# EAGLE design OSB_Motherboard_RevA (EAGLE 9.5.1)
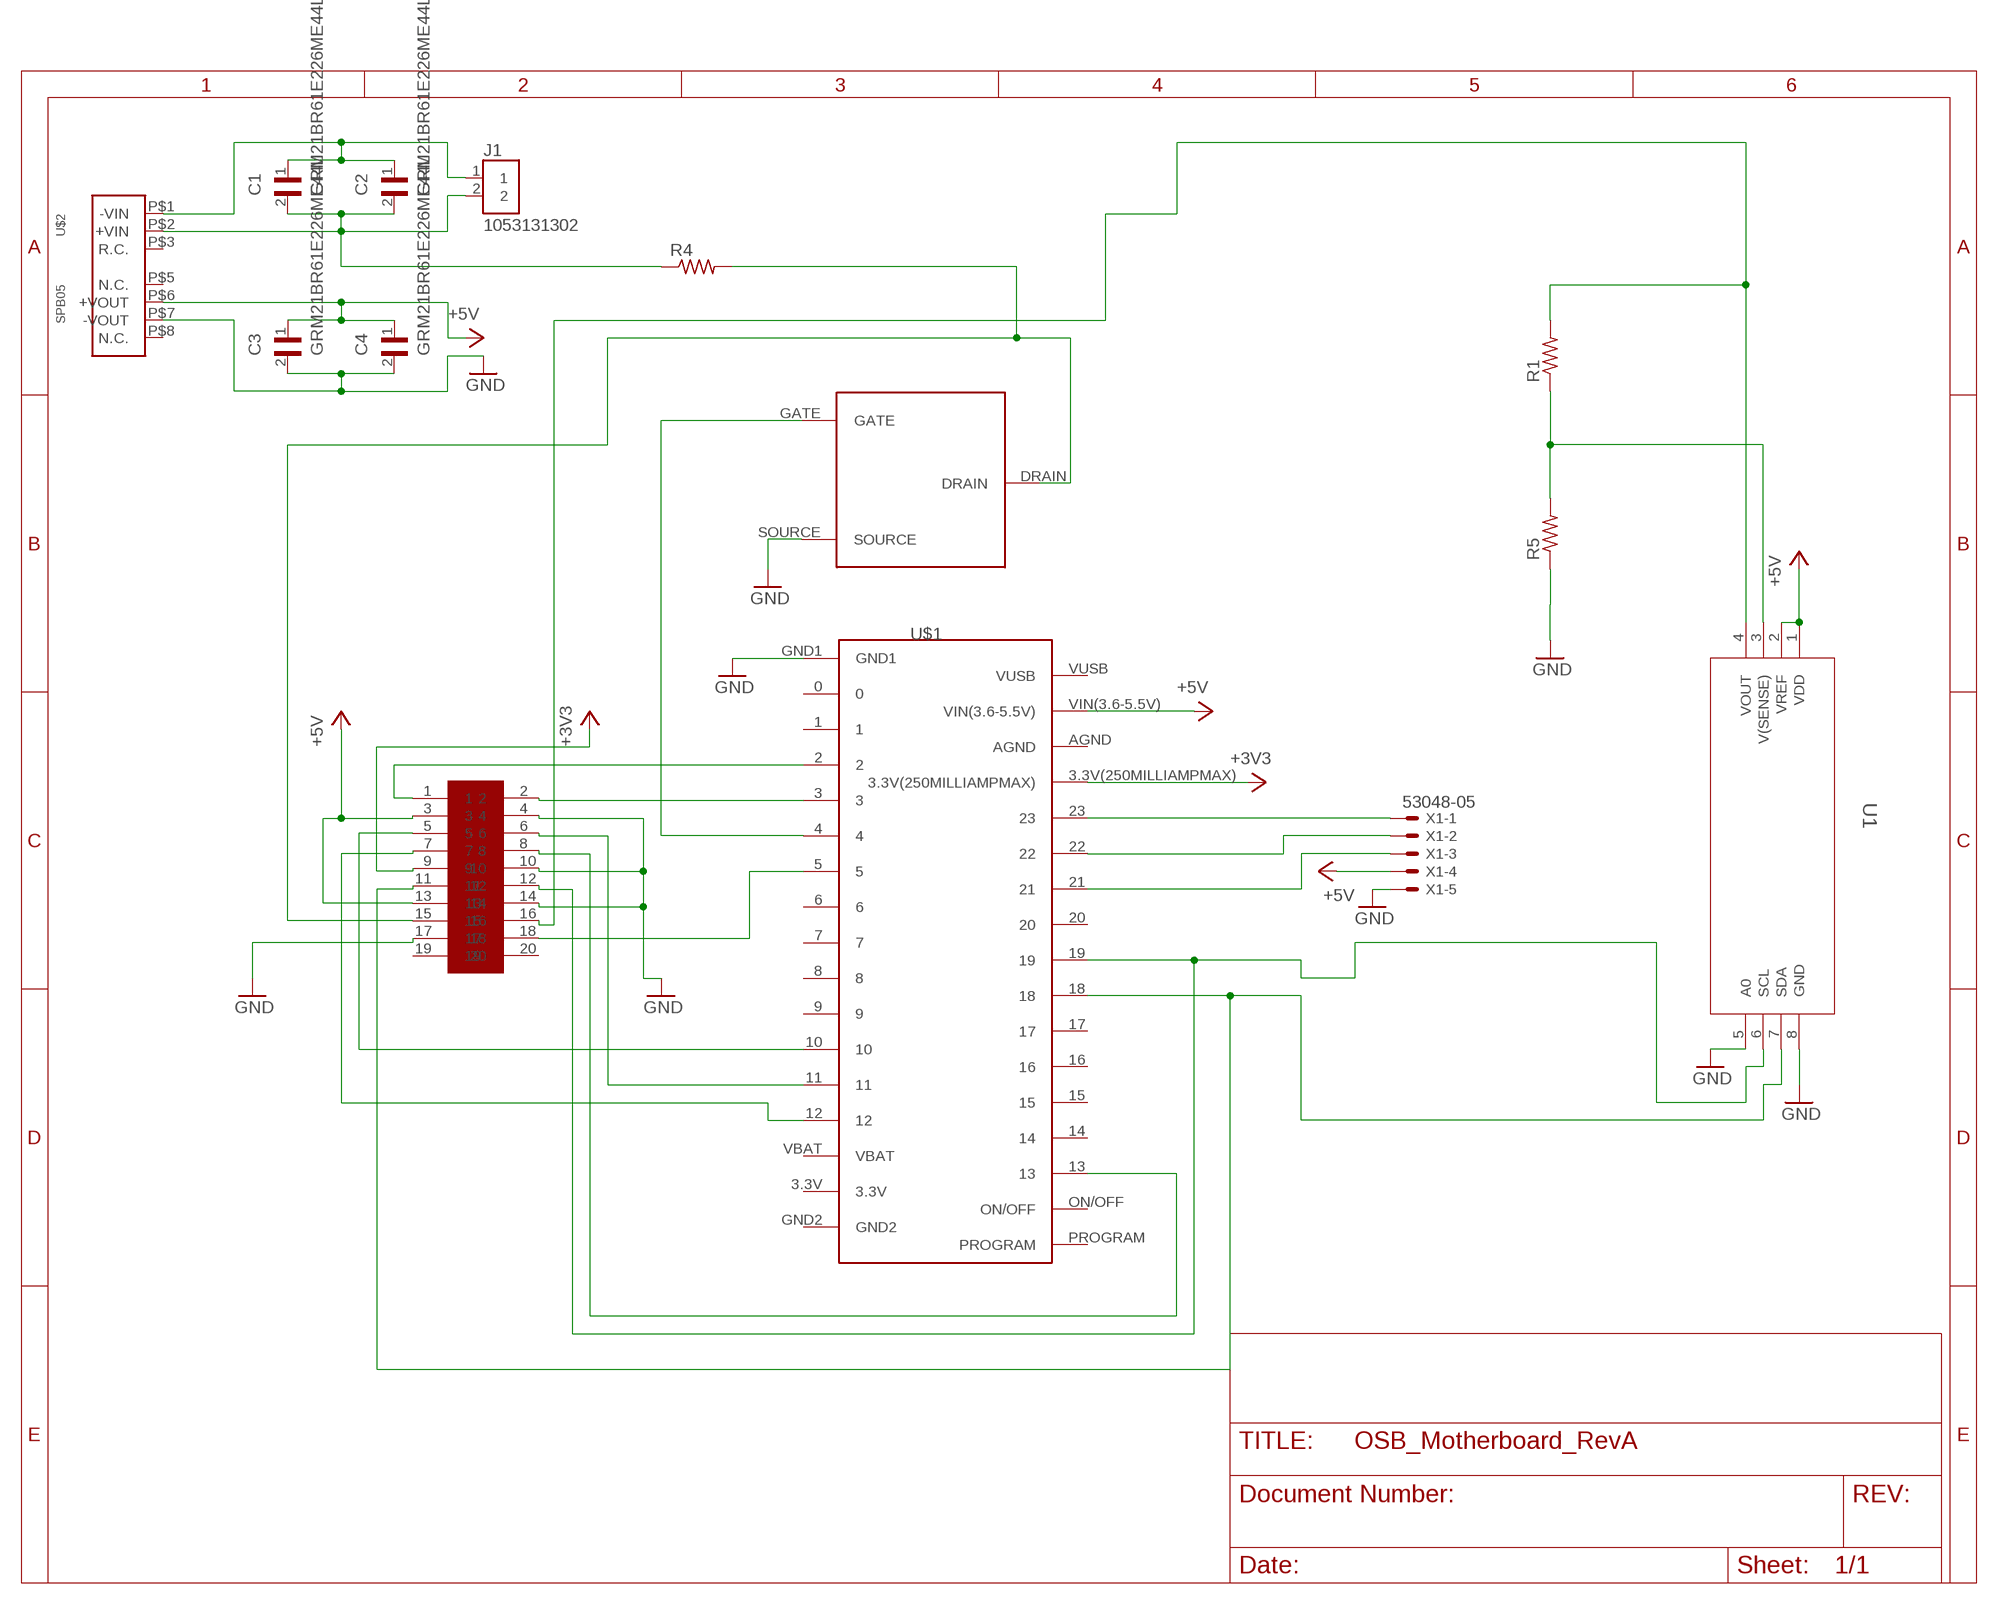
[diagram p0: schematic, sheet 1]

## Parts
C1  GRM21BR61E226ME44L  [CAPC2012X135N]
C2  GRM21BR61E226ME44L  [CAPC2012X135N]
C3  GRM21BR61E226ME44L  [CAPC2012X135N]
C4  GRM21BR61E226ME44L  [CAPC2012X135N]
J1  1053131302  [MOLEX_1053131302]
R1  R-US_R0603  [R0603]
R4  R-US_R0603  [R0603]
R5  R-US_R0603  [R0603]
U1  DAC8571IDGKR  [DGK8]
U$1  TEENSEY4.0  [TEENSEY4.0]
U$2  SPB05  [SPB05B-05]
U$3  MGSF1N02L  [MGSF1N02L]
U$4  MOLEX-PICOCLASP-2CIR  [MOLEX-PICOCLASP-2CIR]
X1  53048-05  [53048-05]

## Nets
+3V3: U$1.3.3V(250MILLIAMPMAX) U$4.9
+5V: C3.1 C4.1 U1.1(VDD) U1.2(VREF) U$1.VIN(3.6-5.5V) U$2.P$6(+VOUT) U$4.3 U$4.13 X1.4
GND: C3.2 C4.2 R5.1 U1.5(A0) U1.8(GND) U$1.GND1 U$2.P$7(-VOUT) U$3.SOURCE U$4.4 U$4.10 U$4.14 U$4.17 X1.5
N$1: U$1.2 U$4.1
N$2: U$1.23 X1.1
N$3: U1.6(SCL) U$1.19 U$4.12
N$4: U1.7(SDA) U$1.18 U$4.11
N$5: U$1.11 U$4.6
N$6: U$1.3 U$4.2
N$7: U$1.13 U$4.8
N$8: U$1.22 X1.2
N$9: U$1.21 X1.3
N$10: U$1.12 U$4.7
N$11: C1.1 C2.1 J1.1 U$2.P$1(-VIN)
N$12: U$1.10 U$4.5
N$14: R1.1 R5.2 U1.3(V(SENSE))
N$15: R1.2 U1.4(VOUT) U$4.16
N$16: U$1.4 U$3.GATE
N$17: R4.2 U$3.DRAIN U$4.15
N$18: C1.2 C2.2 J1.2 R4.1 U$2.P$2(+VIN)
N$19: U$1.5 U$4.18
Unconnected: U$1.0 U$1.1 U$1.3.3V U$1.6 U$1.7 U$1.8 U$1.9 U$1.14 U$1.15 U$1.16 U$1.17 U$1.20 U$1.AGND U$1.GND2 U$1.ON/OFF U$1.PROGRAM U$1.VBAT U$1.VUSB U$2.P$3(R.C.) U$2.P$5(N.C.) U$2.P$8(N.C.) U$4.19 U$4.20

## Library data of the parts
C1-C4 = GRM21BR61E226ME44L:GRM21BR61E226ME44L: Cap Ceramic 22uF 25V X5R 20% Pad SMD 0805 85?C T/R; AVAILABILITY: Unavailable; DESCRIPTION: 0805 22 uF 25 V ±20% Tolerance X5R SMT Multilayer Ceramic Capacitor; MF: Murata Electronics; MP: GRM21BR61E226ME44L; PACKAGE: 0805 Murata; PRICE: None
J1 = 1053131302:1053131302: Nano-Fit Right Angle Header; Through Hole; 2.50mm; Single Row; 2 Circuit; Gold Plated; AVAILABILITY: Unavailable; DESCRIPTION: Nano-Fit Right Angle Header; Through Hole; 2.50mm; Single Row; 2 Circuit; Gold Plated; MF: Molex; MP: 1053131202; PACKAGE: None; PRICE: None
R1 R4 R5 = rcl:R-US_: RESISTOR, American symbol; SPICEPREFIX: R
U1 = Texas Instruments DAC:DAC8571IDGKR; MANUFACTURER_PART_NUMBER: DAC8571IDGKR; VENDOR: Texas Instruments
U$1 = PJRC:TEENSEY4.0
U$2 = MEANWELL_BUCK_CONVERTER:SPB05
U$3 = MGSF1N02L:MGSF1N02L
U$4 = MOLEX-PICOCLASP:MOLEX-PICOCLASP-2CIR
X1 = con-molex:53?-05: CONNECTOR wire to board 1.25 mm (.049 inch) pitch header; MF: MOLEX; MPN: 53048-0510; OC_FARNELL: 9732926; OC_NEWARK: 57H4722

## Board
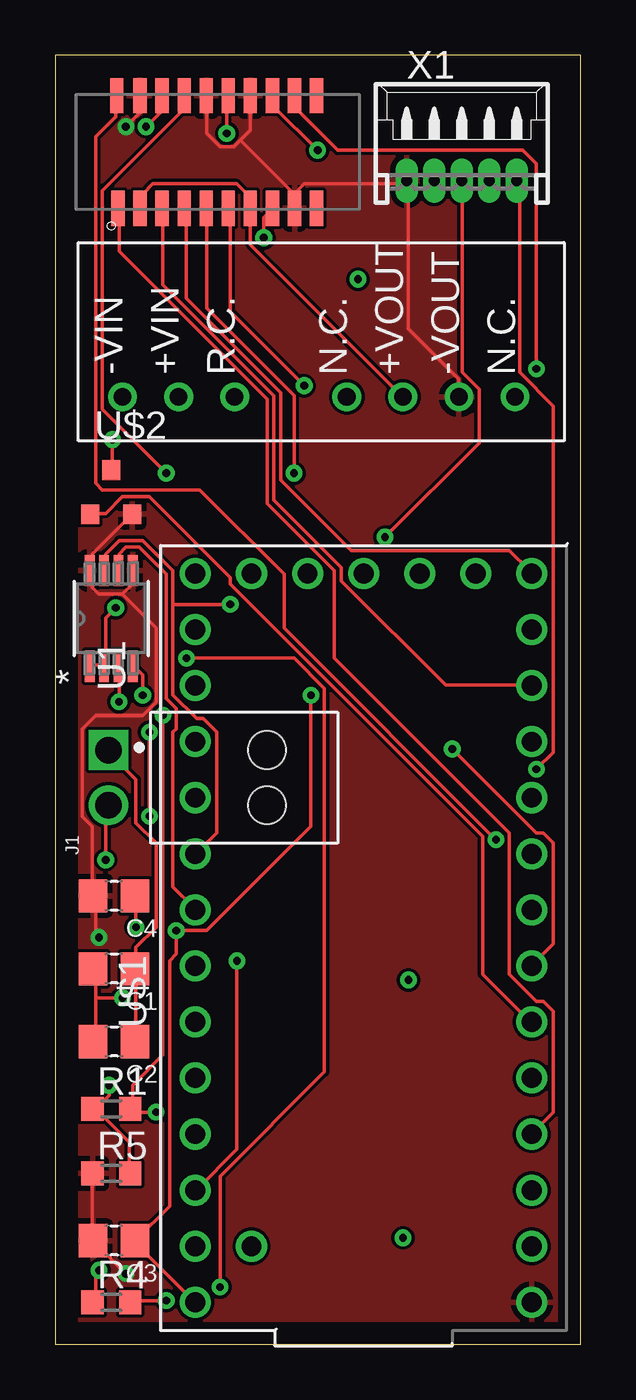
[diagram p1: board, top side]
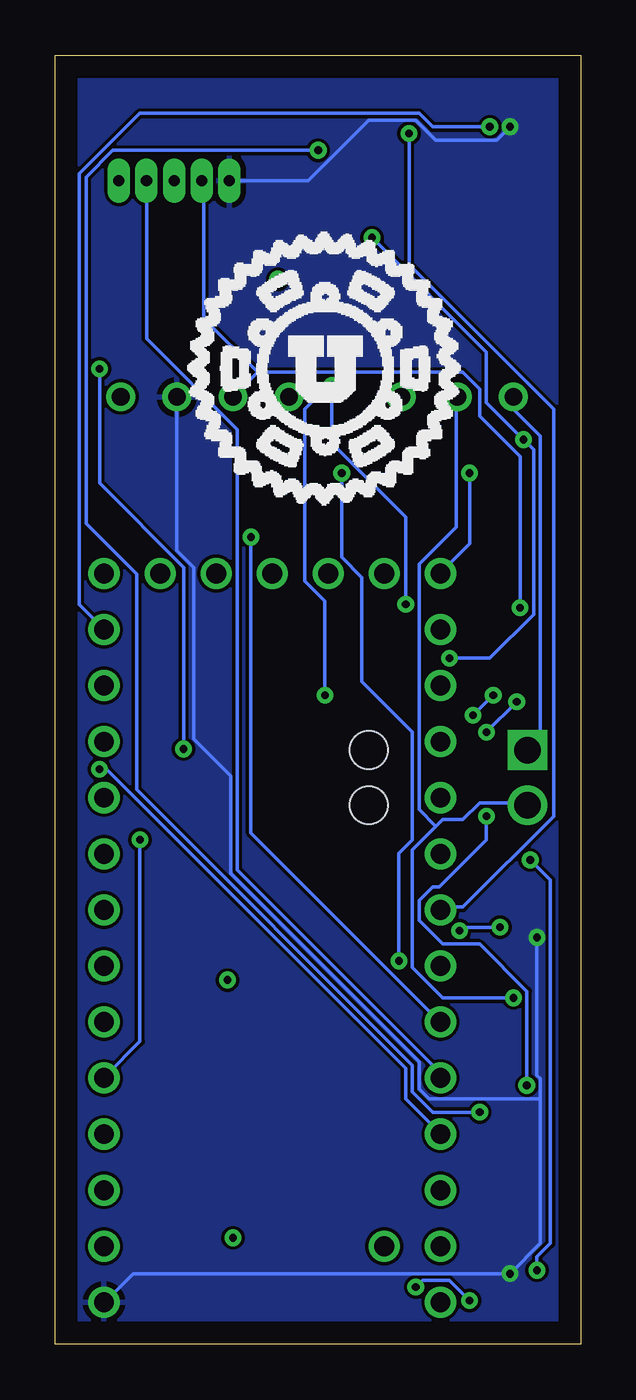
[diagram p2: board, bottom side, seen from below]

Size 23.8 x 58.41 mm. Coordinates in mm from the lower left corner, seen from the top.
Outline: 0,0 23.8,0 23.8,58.41 0,58.41 0,0
Copper layers (1*16): Top 0.035mm / dielectric 1.5mm / Bottom 0.035mm
Design rules "default": minimum track width 6mil, minimum drill 0.35mm, track to track 6mil, track to pad 6mil, pad to pad 6mil, via to via 6mil, smd to smd 6mil, copper to edge 40mil, drill to drill 6mil, minimum pad ring 10mil, minimum via ring 8mil, stop-mask expansion 4mil, vias tented up to drill 0mil, thermal gap 10mil

### Footprints (pad centres in the part's own frame; a part is rotated, then mirrored left to right if it is on the bottom)
CAPC2012X135N = smd 1.3 x 1.5: 1 -0.95,0; 2 0.95,0
MOLEX_1053131302 = drill 1.2 square: 1 0,0 | drill 1.2: 2 -2.5,0 | hole 1.7: 0,-7.18; -2.5,-7.18
R0603 = smd 1 x 1.1: 1 -0.85,0; 2 0.85,0
DGK8 = smd 1.411 x 0.441: 1 -2.172,0.975; 2 -2.172,0.325; 3 -2.172,-0.325; 4 -2.172,-0.975; 5 2.172,-0.975; 6 2.172,-0.325; 7 2.172,0.325; 8 2.172,0.975
TEENSEY4.0 = drill 0.9: 0 -13.97,-7.62; 1 -11.43,-7.62; 2 -8.89,-7.62; 3 -6.35,-7.62; 3.3V 16.51,-2.54; 3.3V(250MILLIAMPMAX) -11.43,7.62; 4 -3.81,-7.62; 5 -1.27,-7.62; 6 1.27,-7.62; 7 3.81,-7.62; 8 6.35,-7.62; 9 8.89,-7.62; 10 11.43,-7.62; 11 13.97,-7.62; 12 16.51,-7.62; 13 16.51,7.62; 14 13.97,7.62; 15 11.43,7.62; 16 8.89,7.62; 17 6.35,7.62; 18 3.81,7.62; 19 1.27,7.62; 20 -1.27,7.62; 21 -3.81,7.62; 22 -6.35,7.62; 23 -8.89,7.62; AGND -13.97,7.62; GND1 -16.51,-7.62; GND2 16.51,0; ON/OFF 16.51,5.08; PROGRAM 16.51,2.54; VBAT 16.51,-5.08; VIN(3.6-5.5V) -16.51,7.62; VUSB -13.97,5.08
SPB05B-05 = drill 0.8: P$1 0,0; P$2 2.54,0; P$3 5.08,0; P$5 10.16,0; P$6 12.7,0; P$7 15.24,0; P$8 17.78,0
MGSF1N02L = smd 0.8 x 0.9: DRAIN 0,1; GATE -0.95,-1; SOURCE 0.95,-1
MOLEX-PICOCLASP-2CIR = smd 0.6 x 1.6: 1 0.3,0.8; 2 0.25,5.9; 3 1.3,0.8; 4 1.3,5.9; 5 2.3,0.8; 6 2.3,5.9; 7 3.3,0.8; 8 3.3,5.9; 9 4.3,0.8; 10 4.3,5.9; 11 5.3,0.8; 12 5.3,5.9; 13 6.3,0.8; 14 6.3,5.9; 15 7.3,0.8; 16 7.3,5.9; 17 8.3,0.8; 18 8.3,5.9; 19 9.3,0.8; 20 9.3,5.9
53048-05 = drill 0.5 pad 0.698 long: 1 2.5,-1.25; 2 1.25,-1.25; 3 0,-1.25; 4 -1.25,-1.25; 5 -2.5,-1.25

### Placement (x,y rotation side)
C1  2.67,17.02 180 top
C2  2.67,13.72 180 top
C3  2.67,4.7 180 top
C4  2.67,20.32 180 top
J1  2.41,26.92 90 top
R1  2.54,10.67 0 top
R4  2.54,1.91 0 top
R5  2.54,7.75 0 top
U1  2.54,32.89 90 top
U$1  13.97,18.41 90 top
U$2  3.05,42.93 0 top
U$3  2.54,38.61 0 top
U$4  2.54,50.67 0 top
X1  18.41,53.98 0 top

### Tracks (layer width: path | path; a pad name or v marks a point on that pad's centre or on a via)
+3V3  (via drill 0.35)
  Top 0.152: v10.82,39.47 10.82,42.98 6.86,46.94 6.86,51.36 U$4.9 | v8.23,17.37 8.23,8.84 6.4,7.01 U$1.3.3V(250MILLIAMPMAX)
  Bottom 0.152: v10.82,39.47 10.82,35.66 9.91,34.75 9.91,30.02 7.62,27.74 7.62,22.86 8.23,22.25 v8.23,17.37
+5V  (via drill 0.35)
  Top 0.152: U$1.VIN(3.6-5.5V) 6.25,1.98 3.66,4.57 C3.1 3.66,4.72 5.18,6.25 5.18,17.37 5.49,17.68 v5.49,18.75 6.86,18.75 11.58,23.47 v11.58,29.41 | v3.66,18.9 3.66,20.27 C4.1 | U$4.3 3.96,51.51 3.96,52.12 4.42,52.58 8.23,52.58 8.84,51.97 8.84,51.51 U$4.13 8.84,51.36 8.84,49.84 U$2.P$6 | U1.1 1.68,30.79 2.13,30.79 U1.2 2.29,30.79 2.29,32.92 v2.74,33.38
  Bottom 0.152: v3.66,18.9 5.33,18.9 v5.49,18.75 | v2.74,33.38 2.74,40.23 4.57,42.06 4.57,43.28 5.33,44.04 12.19,44.04 | 14.63,44.04 12.19,44.04 | U$2.P$6 14.63,44.04 | 14.63,44.04 17.07,46.48 17.07,52.58 X1.4 | v11.58,29.41 11.58,33.68 12.5,34.59 12.5,42.37 12.19,42.67 12.19,44.04
GND  (via drill 0.35)
  Top 0.152: 8.38,54.56 8.84,55.02 8.84,56.54 U$4.14 | 8.38,54.56 8.08,54.25 7.47,54.25 6.86,54.86 6.86,56.54 U$4.10 | 10.82,52.12 10.82,51.51 U$4.17 10.82,52.12 | 8.38,54.56 10.82,52.12 | v3.2,55.17 3.81,55.78 3.81,56.54 U$4.4 | U$2.P$7 18.29,43.74 16,46.02 16,52.58 X1.5 15.85,52.58 11.28,52.58 10.82,52.12 | U$3.SOURCE 3.35,37.49 1.68,35.81 1.68,35.2 U1.8 1.68,35.05 1.68,34.29 1.98,33.98 3.05,33.98 | 3.05,33.98 3.5,34.44 3.5,35.05 U1.5 | 3.05,33.98 4.57,32.46 4.57,29.11 3.96,28.5 1.83,28.5 1.22,27.89 1.22,23.93 1.68,23.47 1.68,20.42 C4.2 1.83,20.27 1.83,18.59 v1.98,18.44 | R5.1 1.68,7.62 1.68,4.72 C3.2 1.83,4.57 v3.2,3.2
  Bottom 0.152: v3.2,55.17 3.81,54.56 6.55,54.56 7.47,55.47 9.6,55.47 12.34,52.73 15.85,52.73 X1.5 | U$1.GND1 21.49,1.98 20.27,3.2 v3.2,3.2 1.83,4.57 1.83,11.12 | v1.98,18.44 1.98,12.19 1.83,12.04 1.83,11.12 | U$2.P$7 18.29,35.97 17.53,35.2 17.53,27.43 15.85,25.76 15.85,21.34 7.32,12.8 7.32,11.58 6.86,11.12 1.83,11.12
  pour Bottom: -3.05,60.96 27.43,60.96 27.43,-4.57 -3.05,-4.57 -3.3,-4.32 -3.3,60.96 -3.05,61.21
  pour Top: -2.79,60.45 26.92,60.45 26.92,-4.06 -3.05,-4.06 -3.05,60.45
N$1
  Top 0.152: U$4.1 2.9,51.36 2.9,49.53 9.6,42.82 9.6,38.1 12.65,35.05 12.65,31.09 20.57,23.16 20.57,16.76 21.79,15.54 22.1,15.54 22.55,15.09 22.55,10.52 21.64,9.6 U$1.2
N$2  (via drill 0.35)
  Top 0.152: v21.79,26.06 22.55,26.82 22.55,42.52 21.03,44.04 21.03,52.58 X1.1
  Bottom 0.152: v21.79,26.06 21.49,26.06 7.92,12.5 7.92,11.12 6.4,9.6 U$1.23
N$3  (via drill 0.35)
  Top 0.152: U1.6 2.9,35.2 2.9,35.81 3.2,36.12 3.81,36.12 5.03,34.9 5.03,29.26 5.49,28.8 5.49,27.89 5.33,27.74 5.33,20.73 6.25,19.81 U$1.19 | v7.77,54.86 7.77,56.54 U$4.12
  Bottom 0.152: v7.77,54.86 7.77,48.92 1.22,42.37 1.22,23.93 5.33,19.81 6.25,19.81 U$1.19
N$4  (via drill 0.35)
  Top 0.152: 5.33,33.53 5.33,29.41 6.4,28.35 6.71,28.35 7.32,27.74 7.32,23.16 6.4,22.25 U$1.18 | 5.33,33.53 5.33,35.05 3.96,36.42 2.9,36.42 2.29,35.81 2.29,35.2 U1.7 | v11.28,43.43 7.92,46.79 7.92,51.36 U$4.11 | 5.33,33.53 v7.92,33.53
  Bottom 0.152: v11.28,43.43 11.28,40.84 7.92,37.49 v7.92,33.53
N$5  (via drill 0.35)
  Top 0.152: v4.12,55.17 4.72,55.78 4.72,56.54 U$4.6
  Bottom 0.152: v4.12,55.17 6.71,55.17 7.32,55.78 19.96,55.78 22.71,53.03 22.71,33.53 21.64,32.46 U$1.11
N$6  (via drill 0.35)
  Top 0.152: v19.96,22.86 10.36,32.46 10.36,34.9 6.55,38.71 2.13,38.71 1.83,39.01 1.83,54.71 2.74,55.63 2.74,56.54 U$4.2
  Bottom 0.152: v19.96,22.86 19.96,13.72 21.49,12.19 U$1.3
N$7  (via drill 0.35)
  Top 0.152: v5.03,39.47 2.13,42.37 2.13,52.27 5.79,55.93 5.79,56.54 U$4.8
  Bottom 0.152: v5.03,39.47 5.03,36.27 6.25,35.05 U$1.13
N$8
  Bottom 0.152: X1.2 19.66,52.58 19.66,45.57 15.54,41.45 15.54,21.49 6.25,12.19 U$1.22
N$9  (via drill 0.35)
  Top 0.152: v14.94,36.58 19.2,40.84 19.2,43.28 18.44,44.04 18.44,52.58 X1.3
  Bottom 0.152: v14.94,36.58 14.94,23.16 6.4,14.63 U$1.21
N$10
  Top 0.152: U$4.7 5.94,51.36 5.94,47.4 10.21,43.13 10.21,39.17 13.41,35.97 20.57,35.97 21.49,35.05 U$1.12
N$11
  Top 0.152: C2.1 3.66,13.72 3.66,16.92 C1.1 3.66,17.07 3.66,17.98 4.57,18.9 4.57,22.71 3.66,23.62 3.66,25.6 2.44,26.82 J1.1
  Bottom 0.152: U$2.P$1 3.05,42.37 1.83,41.15 1.83,27.43 2.29,26.98 J1.1
N$12
  Top 0.152: U$4.5 4.88,51.36 4.88,48.01 9.91,42.98 9.91,38.25 12.95,35.2 12.95,34.59 17.68,29.87 21.49,29.87 U$1.10
N$13  (via drill 0.35)
  other vias: 15.75,4.83
N$14  (via drill 0.35)
  Top 0.152: 1.83,10.67 3.35,9.14 3.35,7.77 R5.2 | v2.9,29.11 2.9,30.63 U1.3 | v4.27,23.93 v4.27,27.74 | v2.44,11.73 2.44,11.28 1.83,10.67 | 1.83,10.67 R1.1
  Bottom 0.152: v4.27,27.74 v2.9,29.11 | v4.27,23.93 4.27,22.86 6.4,20.73 6.71,20.73 7.32,20.12 7.32,19.2 6.25,18.14 4.57,18.14 2.44,16 v2.44,11.73
N$15  (via drill 0.35)
  Top 0.152: 3.5,10.67 3.5,11.73 4.88,13.11 v4.88,28.5 | v3.96,29.41 3.96,30.33 3.66,30.63 U1.4 | v11.89,54.1 9.91,56.08 9.91,56.54 U$4.16 | v4.57,10.52 3.66,10.52 3.5,10.67 | 3.5,10.67 R1.2
  Bottom 0.152: v3.96,29.41 v4.88,28.5 | v11.89,54.1 21.18,54.1 22.4,52.88 22.4,37.19 20.12,34.9 20.12,25.15 7.62,12.65 7.62,11.43 6.71,10.52 v4.57,10.52
N$16
  Top 0.152: U$3.GATE 1.68,37.64 2.29,37.64 3.05,38.41 4.27,38.41 7.92,34.75 7.92,34.44 19.36,23.01 19.36,16.76 21.49,14.63 U$1.4
N$17  (via drill 0.35)
  Top 0.152: v2.59,41 2.59,39.62 U$3.DRAIN | v9.45,50.14 9.45,51.05 9.75,51.36 U$4.15 | v5.03,1.98 3.5,1.98 R4.2 | v7.47,2.59 7.47,7.62 12.19,12.34 12.19,29.72 10.82,31.09 v5.94,31.09
  Bottom 0.152: v9.45,50.14 4.27,44.96 4.27,42.67 v2.59,41 2.13,40.54 2.13,33.07 4.12,31.09 v5.94,31.09 | v5.03,1.98 5.94,2.9 7.16,2.9 v7.47,2.59
N$18  (via drill 0.35)
  Top 0.152: 1.83,15.7 1.83,16.92 C1.2 | 1.83,15.7 1.83,13.72 C2.2 | v1.98,3.35 1.83,3.2 1.83,1.98 R4.1 | v2.29,21.95 2.29,24.38 J1.2 | v3.05,15.7 1.83,15.7
  Bottom 0.152: v1.98,3.35 1.98,3.96 1.37,4.57 1.37,21.03 v2.29,21.95 | v3.05,15.7 6.25,15.7 7.62,17.07 7.62,22.4 6.55,23.47 | 6.55,23.47 6.25,23.77 5.33,23.77 4.57,24.54 2.44,24.54 J1.2 | 6.55,23.47 7.32,24.23 7.32,35.36 5.64,37.03 5.64,42.82 U$2.P$2
N$19  (via drill 0.35)
  Top 0.152: v21.79,44.2 21.79,53.49 21.18,54.1 12.8,54.1 10.97,55.93 10.97,56.54 U$4.18 | v17.98,26.98 21.79,23.16 22.1,23.16 22.55,22.71 22.55,18.14 21.64,17.22 U$1.5
  Bottom 0.152: v21.79,44.2 21.79,39.01 17.98,35.2 v17.98,26.98
N$20  (via drill 0.35)
  other vias: 16,16.51
N$21  (via drill 0.35)
  other vias: 13.72,48.26